# Altium schematic sheet 3_外设.schdoc.schdoc
size 309 x 223 mm; Symbol: Sheet-Symbol_A4; Device: Sheet-Symbol_A4; Company: 嘉立创EDA; Drawed: 吴登珂; Version: V1.0; Page Size: A4; @Project Name: 最小系统板; @Page Count: 4; @Update Date: 2024-04-06; @Create Date: 2024-04-06; @Schematic Name: Schematic1; @Page No: 4; @Page Name: 外设
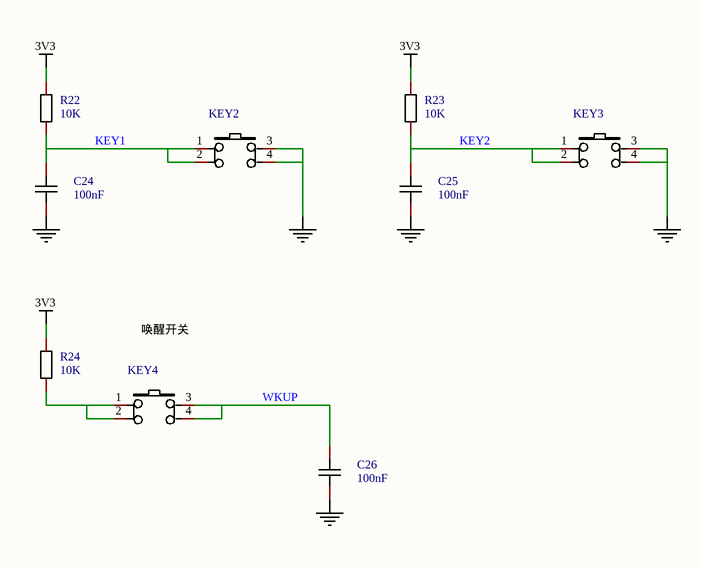
[diagram p0: 3_外设.schdoc.schdoc]

## Parts
C24  100nF  [C0603]
C25  100nF  [C0603]
C26  100nF  [C0603]
KEY2  6x6x6塑料头  [SW-SMD_4P-L6.0-W6.0-P4.50-LS8.6]  (value not drawn)
KEY3  6x6x6塑料头  [SW-SMD_4P-L6.0-W6.0-P4.50-LS8.6]  (value not drawn)
KEY4  6x6x6塑料头  [SW-SMD_4P-L6.0-W6.0-P4.50-LS8.6]  (value not drawn)
R22  10K  [R0603]
R23  10K  [R0603]
R24  10K  [R0603]

## Nets
3V3: R22.2 R23.2 R24.2
NetC24_1: C24.1 C25.1 C26.1 KEY2.3 KEY2.4 KEY3.3 KEY3.4
KEY1: C24.2 KEY2.1 KEY2.2 R22.1
KEY2: C25.2 KEY3.1 KEY3.2 R23.1
WKUP: C26.2 KEY4.3 KEY4.4
NetKEY4_1: KEY4.1 KEY4.2 R24.1

## Notes on the sheet
- 唤醒开关
- 1
- 2
- 3
- 4
- 5
- 6
- A
- B
- C
- 原理图
- Schematic1
- 创建日期
- 更新日期
- 2024-04-06
- 审阅
- 绘制
- 图页
- 吴登珂
- 外设
- 物料编码
- 最小系统板
- D
- 版本
- 尺寸
- 页
- 共
- V1.0
- A4
- 嘉立创EDA

## Library data of the parts
C24-C26 = CAP_0603: Symbol: CapAcitance; Convert to PCB: yes; Name: 100nF; Device: CAP_0603; Add into BOM: yes; Supplier Footprint: 0603; Value: 100nF
KEY2-KEY4 = 6x6x6塑料头: Manufacturer: 国产; Symbol: 6x6x6Plastic head; Add into BOM: yes; Switch Length: 6mm; Description: 开关长度:6mm;开关宽度:6mm;开关高度:6mm;机械寿命:-;; Name: 6x6x6塑料头; Device: 6x6x6塑料头; Supplier Part: C23550; Supplier: LCSC; Manufacturer Part: 6x6x6塑料头; JLCPCB Part Class: 扩展库; LCSC Part Name: 6x6x6 塑料头; Supplier Footprint: SMD; Datasheet: https://atta.szlcsc.com/upload/public/pdf/source/20150923/1457707411939.pdf; Convert to PCB: yes; Switch Width: 6mm; Switch Height: 6mm; Mechanical Life: -
R22-R24 = Res_0603: Symbol: 电阻; Convert to PCB: yes; Name: 10K; Device: Res_0603; Add into BOM: yes; Supplier Footprint: 0603; Value: 10K